# EAGLE schematic Midimiddleman (EAGLE 9.6.2)
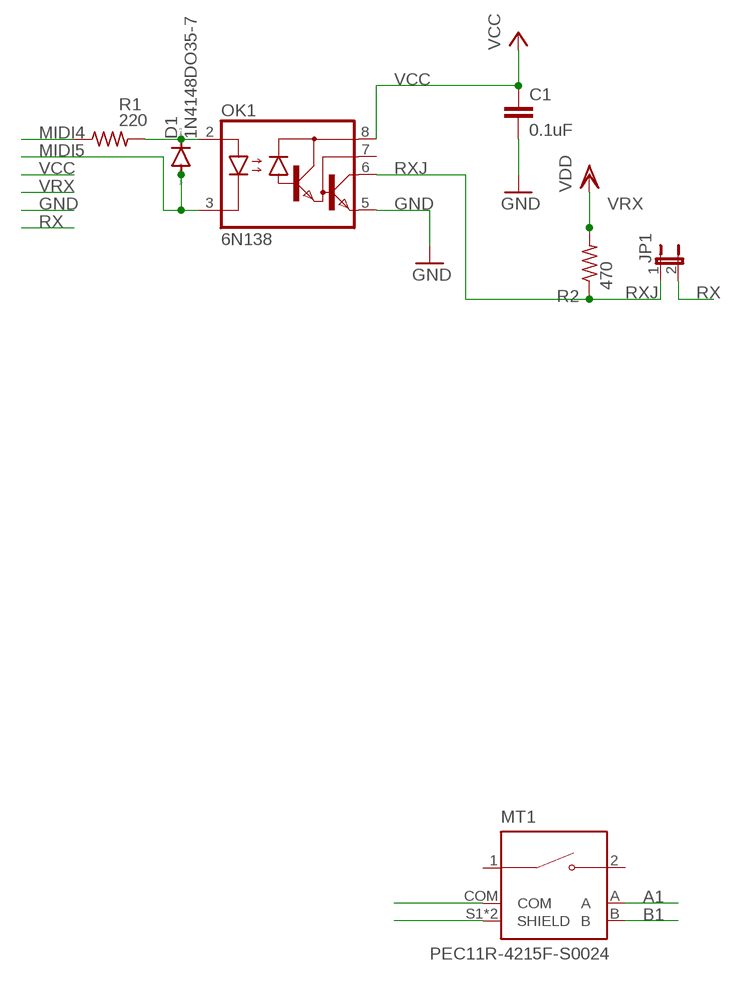
[diagram p0: schematic, sheet 1]

## Parts
C1  0.1uF  C10/5  [C10B5]
D1  1N4148DO35-7  [DO35-7]
JP1  JP1E  [JP1]
MT1  PEC11R-4215F-S0024  [XDCR_PEC11R-4215F-S0024]
OK1  6N138  [DIL08]
R1  220  R-US_0207/10  [0207/10]
R2  470  R-US_0207/10  [0207/10]

## Nets
A1: MT1.A
B1: MT1.B
GND: C1.2 MT1.COM MT1.S1(SHIELD) MT1.S2(SHIELD) OK1.5(GND)
MIDI4: R1.1
MIDI5: D1.A OK1.3(C)
N$8: D1.C OK1.2(A) R1.2
RX: JP1.2
RXJ: JP1.1 OK1.6(VO) R2.1
VCC: C1.1 OK1.8(VCC)
VRX: R2.2 ; supply symbol labelled VDD
Unconnected: MT1.1 MT1.2 OK1.7(VB)

## Library data of the parts
C1 = capacitor-wima:C: CAPACITOR naming: grid - package width
D1 = diode:1N4148: DIODE high speed (Philips)
JP1 = jumper:JP1E: JUMPER
MT1 = PEC11R-4215F-S0024:PEC11R-4215F-S0024: Incremental Encoder, 12 Mm, Contact Rating 10 Ma - 5 Vdc Check prices <https://pricing.snapeda.com/parts/PEC11R-4215F-S0024/Bourns/view-part?ref=eda>; AVAILABILITY: In Stock; DESCRIPTION: Rotary Encoder Mechanical 24 Quadrature (Incremental) Vertical; MF: Bourns; MP: PEC11R-4215F-S0024; PACKAGE: None; PRICE: None; PURCHASE-URL: https://pricing.snapeda.com/search/part/PEC11R-4215F-S0024/?ref=eda
OK1 = optocoupler:6N138: MOTOROLA OPTO COUPLER; MF: VISHAY/TELEFUNKEN; MPN: 6N138; OC_FARNELL: 9860150; OC_NEWARK: 35K5294
R1 R2 = rcl:R-US_: RESISTOR, American symbol; SPICEPREFIX: R